# Altium schematic sheet comm_sensing.SchDoc
size A
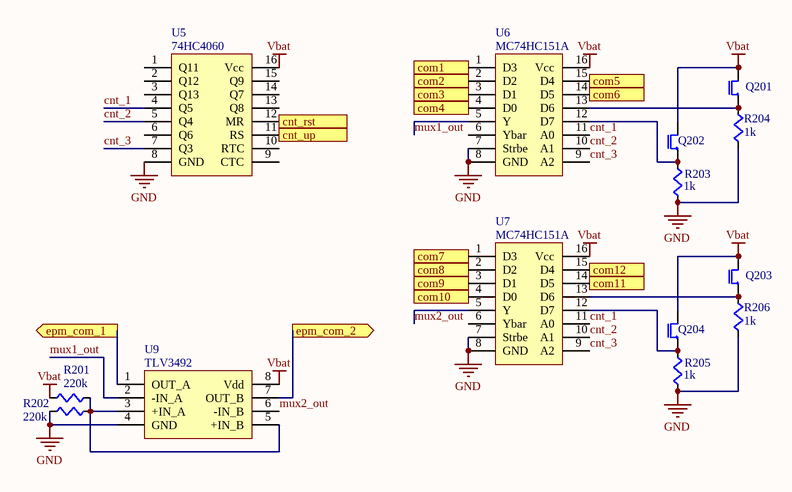
[diagram p0: comm_sensing.SchDoc]

## Parts
Q201  PHOTOTRANS  [smd_phototrans]  (value not drawn)
Q202  PHOTOTRANS  [smd_phototrans]  (value not drawn)
Q203  PHOTOTRANS  [smd_phototrans]  (value not drawn)
Q204  PHOTOTRANS  [smd_phototrans]  (value not drawn)
R201  value 220k  [SMD0603]  (hidden comment: Res)
R202  value 220k  [SMD0603]  (hidden comment: Res)
R203  value 1k  [SMD0603]  (hidden comment: Res)
R204  value 1k  [SMD0603]  (hidden comment: Res)
R205  value 1k  [SMD0603]  (hidden comment: Res)
R206  value 1k  [SMD0603]  (hidden comment: Res)
U5  74HC4060  [dhvqfn-16]
U6  MC74HC151A  [soic-16]
U7  MC74HC151A  [soic-16]
U9  TLV3492  [sot23-8]

## Ports
cnt_rst (in), cnt_up (in), com1 (in), com2 (in), com3 (in), com4 (in), com5 (in), com6 (in), com7 (in), com8 (in), com9 (in), com10 (in), com11 (in), com12 (in), epm_com_1 (out), epm_com_2 (out)

## Nets
GND: R202.2 R203.2 R204.2 R205.2 R206.2 U5.8(GND) U6.7(Strbe) U6.8(GND) U7.7(Strbe) U7.8(GND) U9.4(GND)
Vbat: Q201.1(Collector) Q202.1(Collector) Q203.1(Collector) Q204.1(Collector) R201.2 U5.16(Vcc) U6.16(Vcc) U7.16(Vcc) U9.8(Vdd)
cnt_1: U5.4(Q5) U6.11(A0) U7.11(A0)
cnt_2: U5.5(Q4) U6.10(A1) U7.10(A1)
cnt_3: U5.7(Q3) U6.9(A2) U7.9(A2)
cnt_rst: U5.12(MR) ; port cnt_rst
cnt_up: U5.11(RS) ; port cnt_up
com1: U6.1(D3) ; port com1
com2: U6.2(D2) ; port com2
com3: U6.3(D1) ; port com3
com4: U6.4(D0) ; port com4
com5: U6.15(D4) ; port com5
com6: U6.14(D5) ; port com6
com7: U7.1(D3) ; port com7
com8: U7.2(D2) ; port com8
com9: U7.3(D1) ; port com9
com10: U7.4(D0) ; port com10
com11: U7.14(D5) ; port com11
com12: U7.15(D4) ; port com12
epm_com_1: U9.1(OUT_A) ; port epm_com_1
epm_com_2: U9.7(OUT_B) ; port epm_com_2
mux1_out: U6.5(Y) U9.2(-IN_A)
mux2_out: U7.5(Y) U9.6(-IN_B)
NetQ201_2: Q201.2(Emitter) R204.1 U6.13(D6)
NetQ202_2: Q202.2(Emitter) R203.1 U6.12(D7)
NetQ203_2: Q203.2(Emitter) R206.1 U7.13(D6)
NetQ204_2: Q204.2(Emitter) R205.1 U7.12(D7)
NetR201_1: R201.1 R202.1 U9.3(+IN_A) U9.5(+IN_B)

Not connected (* = marked no-connect by the designer): U5 1(Q11) 2(Q12) 3(Q13) 6(Q6) 9(CTC) 10(RTC) 13(Q8) 14(Q7) 15(Q9); U6 6(Ybar); U7 6(Ybar)

## Library data of the parts
R201-R206 = Resistor